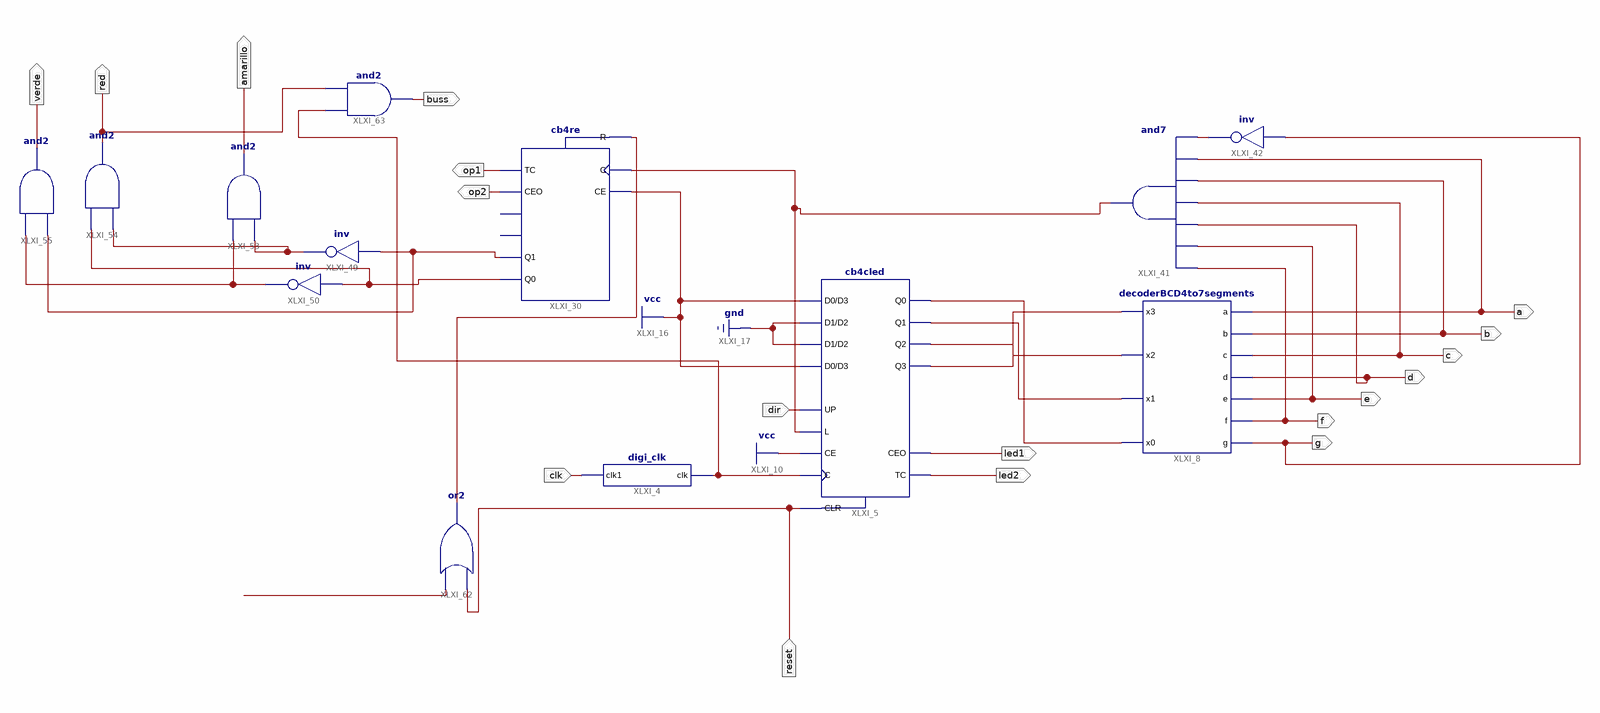
[diagram p0: schematic sheet 1]
// Xilinx ISE schematic timer.sch (spartan3e) as structural Verilog: 13 symbols, 18 ports
module timer (
  input  clk,
  input  dir,
  input  reset,
  output b,
  output c,
  output d,
  output f,
  output g,
  output led1,
  output led2,
  output a,
  output e,
  output op1,
  output op2,
  output red,
  output verde,
  output amarillo,
  output buss
);

  wire buzz, XLXN_58, XLXN_60, XLXN_61, XLXN_82, XLXN_128, XLXN_139, XLXN_145, XLXN_148, XLXN_149, XLXN_169,
       XLXN_170, XLXN_182;

  digi_clk XLXI_4 (.clk1(clk), .clk(buzz));
  decoderBCD4to7segments XLXI_8 (
    .x3(XLXN_82), .x2(XLXN_61), .x1(XLXN_60), .x0(XLXN_58), .a(a), .b(b), .c(c), .d(d), .e(e), .f(f), .g(g));
  cb4cled XLXI_5 (
    .C(buzz), .CE(1'b1), .CLR(reset), .D0(1'b1), .D1(1'b0), .D2(1'b0), .D3(1'b1), .L(XLXN_182), .UP(dir),
    .CEO(led1), .Q0(XLXN_58), .Q1(XLXN_60), .Q2(XLXN_61), .Q3(XLXN_82), .TC(led2));
  cb4re XLXI_30 (
    .C(XLXN_182), .CE(1'b1), .R(XLXN_170), .CEO(op2), .Q0(XLXN_149), .Q1(XLXN_148), .TC(op1));  // open: Q2, Q3
  and XLXI_41 (XLXN_182, XLXN_128, a, b, c, d, e, f);
  not XLXI_42 (XLXN_128, g);
  not XLXI_49 (XLXN_145, XLXN_148);
  not XLXI_50 (XLXN_139, XLXN_149);
  and XLXI_55 (verde, XLXN_148, XLXN_139);
  and XLXI_53 (amarillo, XLXN_145, XLXN_139);
  and XLXI_54 (red, XLXN_145, XLXN_149);
  or XLXI_62 (XLXN_170, reset, XLXN_169);
  and XLXI_63 (buss, buzz, red);
endmodule
